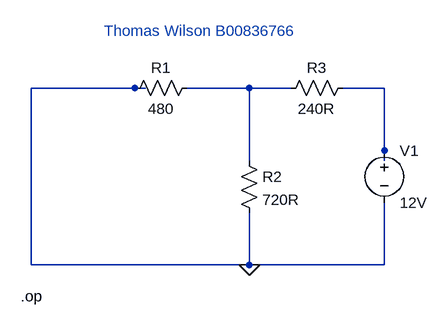
[diagram p0: schematic lab 4 circuit 3.asc]
lab 4 circuit 3.asc, the LTspice schematic file:
Version 4
SHEET 1 880 680
WIRE 160 0 0 0
WIRE 176 0 160 0
WIRE 336 0 240 0
WIRE 400 0 336 0
WIRE 544 0 480 0
WIRE 544 96 544 0
WIRE 336 112 336 0
WIRE 544 112 544 96
WIRE 0 272 0 0
WIRE 336 272 336 192
WIRE 336 272 0 272
WIRE 544 272 544 176
WIRE 544 272 336 272
FLAG 336 272 0
DATAFLAG 544 16 ""
DATAFLAG 544 256 "I(V1)"
SYMBOL voltage 544 80 R0
WINDOW 123 0 0 Left 0
WINDOW 39 0 0 Left 0
SYMATTR InstName V1
SYMATTR Value 12V
SYMBOL res 256 -16 R90
WINDOW 0 0 56 VBottom 2
WINDOW 3 32 56 VTop 2
SYMATTR InstName R1
SYMATTR Value 480
SYMBOL res 496 -16 R90
WINDOW 0 0 56 VBottom 2
WINDOW 3 32 56 VTop 2
SYMATTR InstName R3
SYMATTR Value 240R
SYMBOL res 320 96 R0
SYMATTR InstName R2
SYMATTR Value 720R
TEXT -16 320 Left 2 !.op
TEXT 112 -88 Left 2 ;Thomas Wilson B00836766

The netlist it stands for:
* lab 4 circuit 3.asc
V1 N002 0 12V
R1 N001 0 480
R3 N002 N001 240R
R2 N001 0 720R
.op
* Thomas Wilson B00836766
.backanno
.end